# EAGLE schematic KGGR_wD_HK (EAGLE 9.4.2)

## Sheet 1 of 2
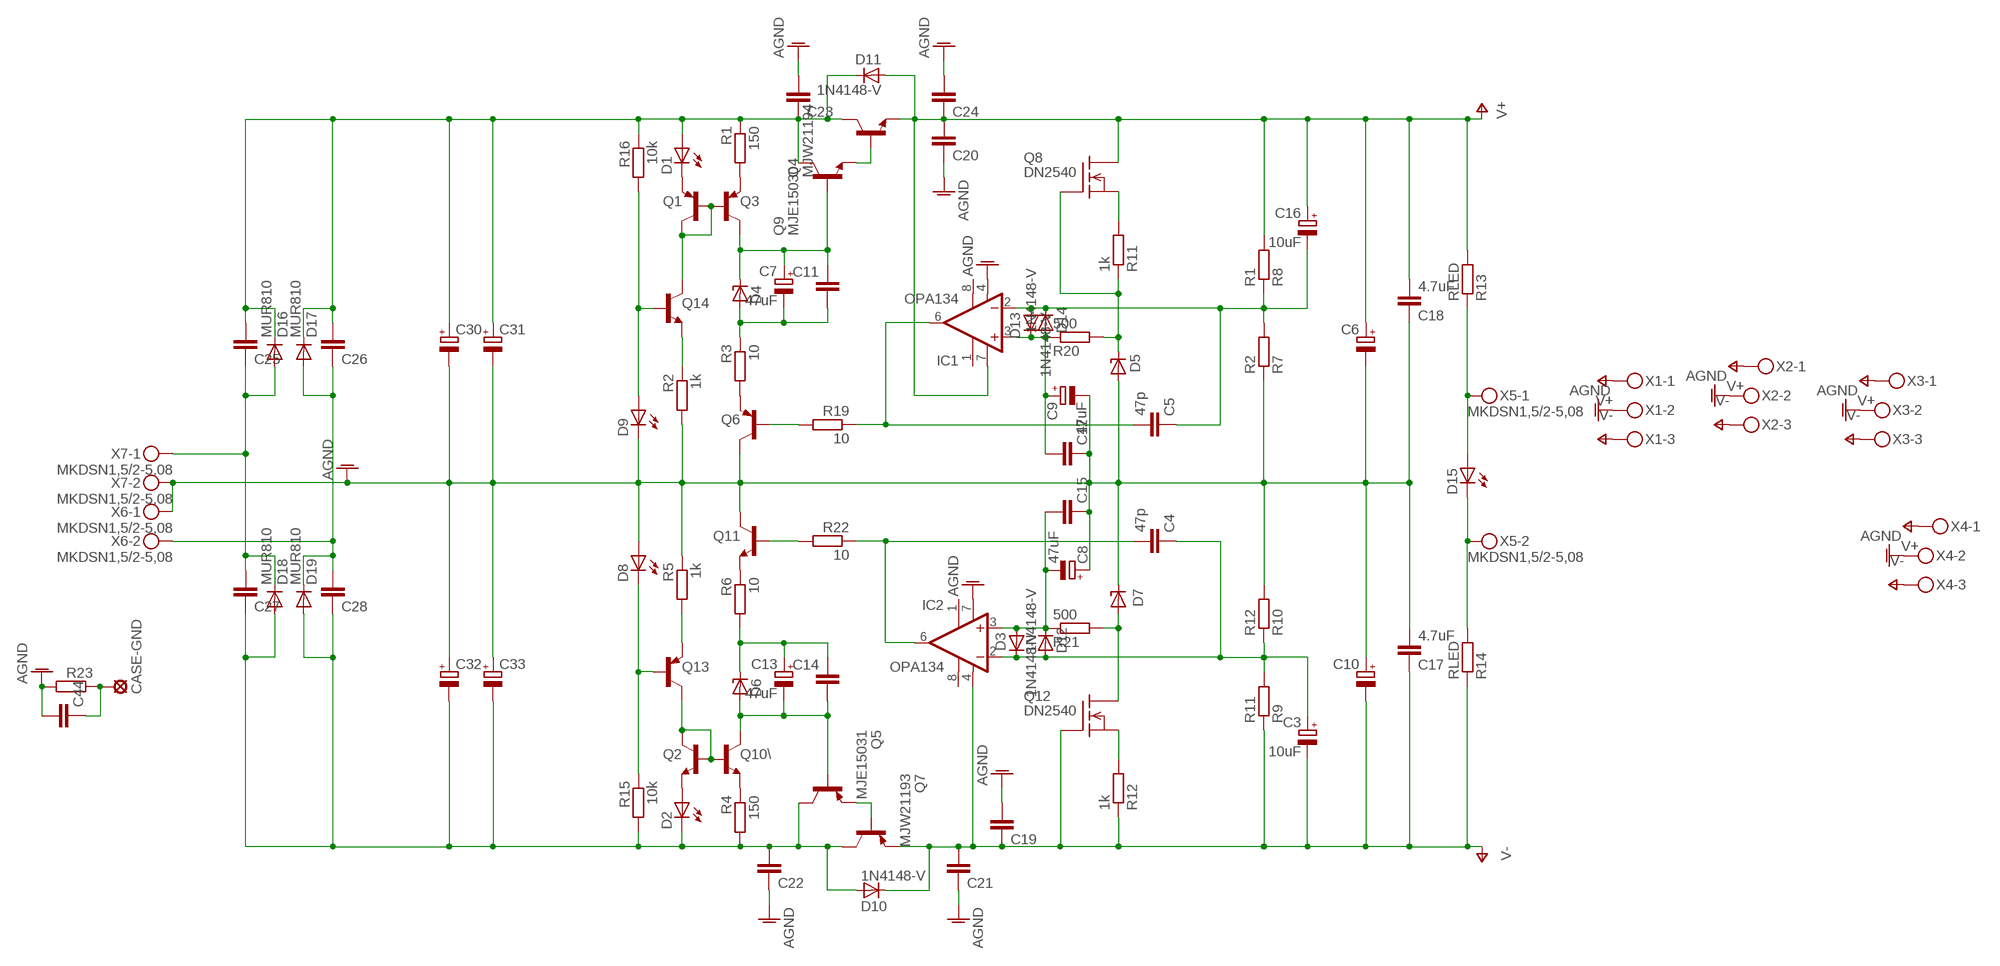
[diagram p0: schematic, sheet 1]

### Parts
C3  10uF  CPOL-EUE5-8.5  [E5-8,5]
C4  47p  C-EU025_050-025X075  [C025_050-025X075]
C5  47p  C-EU025_050-025X075  [C025_050-025X075]
C6  CPOL-EUE7.5-18  [E7,5-18]
C7  47uF  CPOL-EUE5-8.5  [E5-8,5]
C8  47uF  CPOL-EUE5-8.5  [E5-8,5]
C9  47uF  CPOL-EUE5-8.5  [E5-8,5]
C10  CPOL-EUE7.5-18  [E7,5-18]
C11  C-EU050-035X075  [C050-035X075]
C12  C-EU050-035X075  [C050-035X075]
C13  47uF  CPOL-EUE5-8.5  [E5-8,5]
C14  C-EU050-035X075  [C050-035X075]
C15  C-EU050-035X075  [C050-035X075]
C16  10uF  CPOL-EUE5-8.5  [E5-8,5]
C17  4.7uF  C-EU050-075X075  [C050-075X075]
C18  4.7uF  C-EU050-075X075  [C050-075X075]
C19  C-EU050-035X075  [C050-035X075]
C20  C-EU050-035X075  [C050-035X075]
C21  C-EU050-035X075  [C050-035X075]
C22  C-EU050-075X075  [C050-075X075]
C23  C-EU050-075X075  [C050-075X075]
C24  C-EU050-035X075  [C050-035X075]
C25  C-EU050-035X075  [C050-035X075]
C26  C-EU050-035X075  [C050-035X075]
C27  C-EU050-035X075  [C050-035X075]
C28  C-EU050-035X075  [C050-035X075]
C30  CPOL-EUE10-35  [EB35D]
C31  CPOL-EUE10-35  [EB35D]
C32  CPOL-EUE10-35  [EB35D]
C33  CPOL-EUE10-35  [EB35D]
C44  C-EU075-052X106  [C075-052X106]
CASE-GND  SE14  [SE14]
D1  LED5MM  [LED5MM]
D2  LED5MM  [LED5MM]
D3  1N4148-V  [1N4148]
D4  1N4728  [DO41Z10]
D5  LT1021  LT1021-V  [DIL08]
D6  1N4728  [DO41Z10]
D7  LT1021  LT1021-V  [DIL08]
D8  LED5MM  [LED5MM]
D9  LED5MM  [LED5MM]
D10  1N4148-V  [1N4148]
D11  1N4148-V  [1N4148]
D12  1N4148-V  [1N4148]
D13  1N4148-V  [1N4148]
D14  1N4148-V  [1N4148]
D15  LED5MM  [LED5MM]
D16  MUR810  [TO220ACS]
D17  MUR810  [TO220ACS]
D18  MUR810  [TO220ACS]
D19  MUR810  [TO220ACS]
IC1  OPA134  OPA134P  [DIL08]
IC2  OPA134  OPA134P  [DIL08]
Q1  MPSA92-PNP-TO92-EBC  [TO92-EBC]
Q2  MPSA42-NPN-TO92-EBC  [TO92-EBC]
Q3  MPSA92-PNP-TO92-EBC  [TO92-EBC]
Q4  MJW21194  MJL4281  [TO-264]
Q5  MJE15031  [TO220KG]
Q6  MPSA92-PNP-TO92-EBC  [TO92-EBC]
Q7  MJW21193  MJL4302  [TO-264]
Q8  DN2540  2N7000  [TO92-]
Q9  MJE15030  [TO220KG]
Q10\  MPSA42-NPN-TO92-EBC  [TO92-EBC]
Q11  MPSA42-NPN-TO92-EBC  [TO92-EBC]
Q12  DN2540  2N7000  [TO92-]
Q13  MPSA92-PNP-TO92-EBC  [TO92-EBC]
Q14  MPSA42-NPN-TO92-EBC  [TO92-EBC]
R1  150  R-EU_0309/12  [0309/12]
R2  1k  R-EU_0309/12  [0309/12]
R3  10  R-EU_0309/12  [0309/12]
R4  150  R-EU_0309/12  [0309/12]
R5  1k  R-EU_0309/12  [0309/12]
R6  10  R-EU_0309/12  [0309/12]
R7  R2  R-EU_0309/12  [0309/12]
R8  R1  R-EU_0309/12  [0309/12]
R9  R11  R-EU_0309/12  [0309/12]
R10  R12  R-EU_0309/12  [0309/12]
R11  1k  R-EU_0309/12  [0309/12]
R12  1k  R-EU_0309/12  [0309/12]
R13  RLED  R-EU_0309/12  [0309/12]
R14  RLED  R-EU_0309/12  [0309/12]
R15  10k  R-EU_0309/12  [0309/12]
R16  10k  R-EU_0309/12  [0309/12]
R19  10  R-EU_0309/12  [0309/12]
R20  500  R-EU_0309/12  [0309/12]
R21  500  R-EU_0309/12  [0309/12]
R22  10  R-EU_0309/12  [0309/12]
R23  R-EU_0411/12  [0411/12]
X1  MKDSN1,5/3-5,08  [MKDSN1,5/3-5,08]
X2  MKDSN1,5/3-5,08  [MKDSN1,5/3-5,08]
X3  MKDSN1,5/3-5,08  [MKDSN1,5/3-5,08]
X4  MKDSN1,5/3-5,08  [MKDSN1,5/3-5,08]
X5  MKDSN1,5/2-5,08  [MKDSN1,5/2-5,08]
X6  MKDSN1,5/2-5,08  [MKDSN1,5/2-5,08]
X7  MKDSN1,5/2-5,08  [MKDSN1,5/2-5,08]

### Nets
AGND: C6.- C8.+ C9.- C10.+ C12.1 C15.1 C17.2 C18.1 C19.2 C20.1 C21.1 C22.1 C23.2 C24.2 C30.- C31.- C32.+ C33.+ C44.2 D5.4(GND) D7.6(OUT) D8.A D9.K(C) IC1.4(V-) IC2.7(V+) Q6.C Q11.C R2.2 R5.1 R7.1 R10.2 R23.2 X1.2 X2.2 X3.2 X4.2 X6.1 X7.2
N$1: Q1.B Q1.C Q3.B Q14.C
N$2: D1.K(C) Q1.E
N$3: Q3.E R1.2
N$4: C23.1 C25.2 C26.2 C30.+ C31.+ D1.A D11.C D16.C D17.C Q4.C Q9.2(C) R1.1 R16.1
N$5: C7.+ C11.1 D4.C Q3.C Q9.1(B)
N$6: C7.- C11.2 D4.A R3.1
N$7: Q6.E R3.2
N$8: Q14.E R2.1
N$9: D9.A Q14.B R16.2
N$10: C8.- C15.2 D3.A D12.C IC2.3(+IN) R21.1
N$11: Q13.E R5.2
N$12: D8.K(C) Q13.B R15.1
N$13: Q11.E R6.1
N$14: C13.+ C14.1 D6.C R6.2
N$15: C13.- C14.2 D6.A Q5.1(B) Q10\.C
N$16: Q2.B Q2.C Q10\.B Q13.C
N$17: Q5.3(E) Q7.B
N$18: Q10\.E R4.1
N$19: D2.A Q2.E
N$21: Q4.B Q9.3(E)
N$22: C22.2 C27.1 C28.1 C32.- C33.- D2.K(C) D10.A D18.A D19.A Q5.2(C) Q7.C R4.2 R15.2
N$23: C25.1 C27.2 D16.A D18.C X7.1
N$24: C5.2 C5.3 IC1.6(OUT) R19.1
N$25: C4.2 C4.3 IC2.6(OUT) R22.1
N$26: Q11.B R22.2
N$27: Q6.B R19.2
N$28: C5.1 C16.- D13.A D14.C IC1.2(-IN) R7.2 R8.1
N$29: Q12.3(S) R12.2
N$30: D5.6(OUT) Q8.2(G) R11.1 R20.2
N$31: C9.+ C12.2 D13.C D14.A IC1.3(+IN) R20.1
N$32: D15.K(C) R14.2 X5.2
N$33: D7.4(GND) Q12.1(D) R21.2
N$34: C3.+ C4.1 D3.C D12.A IC2.2(-IN) R9.2 R10.1
N$35: Q8.3(S) R11.2
N$36: D15.A R13.1 X5.1
N$38: C26.1 C28.2 D17.A D19.C X6.2
N$45: C44.1 CASE-GND.MP R23.1
V+: C6.+ C16.+ C18.2 C20.2 C24.1 D11.A IC1.7(V+) Q4.E Q8.1(D) R8.2 R13.2 X1.1 X2.1 X3.1 X4.1
V-: C3.- C10.- C17.1 C19.1 C21.2 D10.C IC2.4(V-) Q7.E Q12.2(G) R9.1 R12.1 R14.1 X1.3 X2.3 X3.3 X4.3
Unconnected: IC1.1(TRIM1) IC1.8(TRIM2) IC2.1(TRIM1) IC2.8(TRIM2)

## Sheet 2 of 2
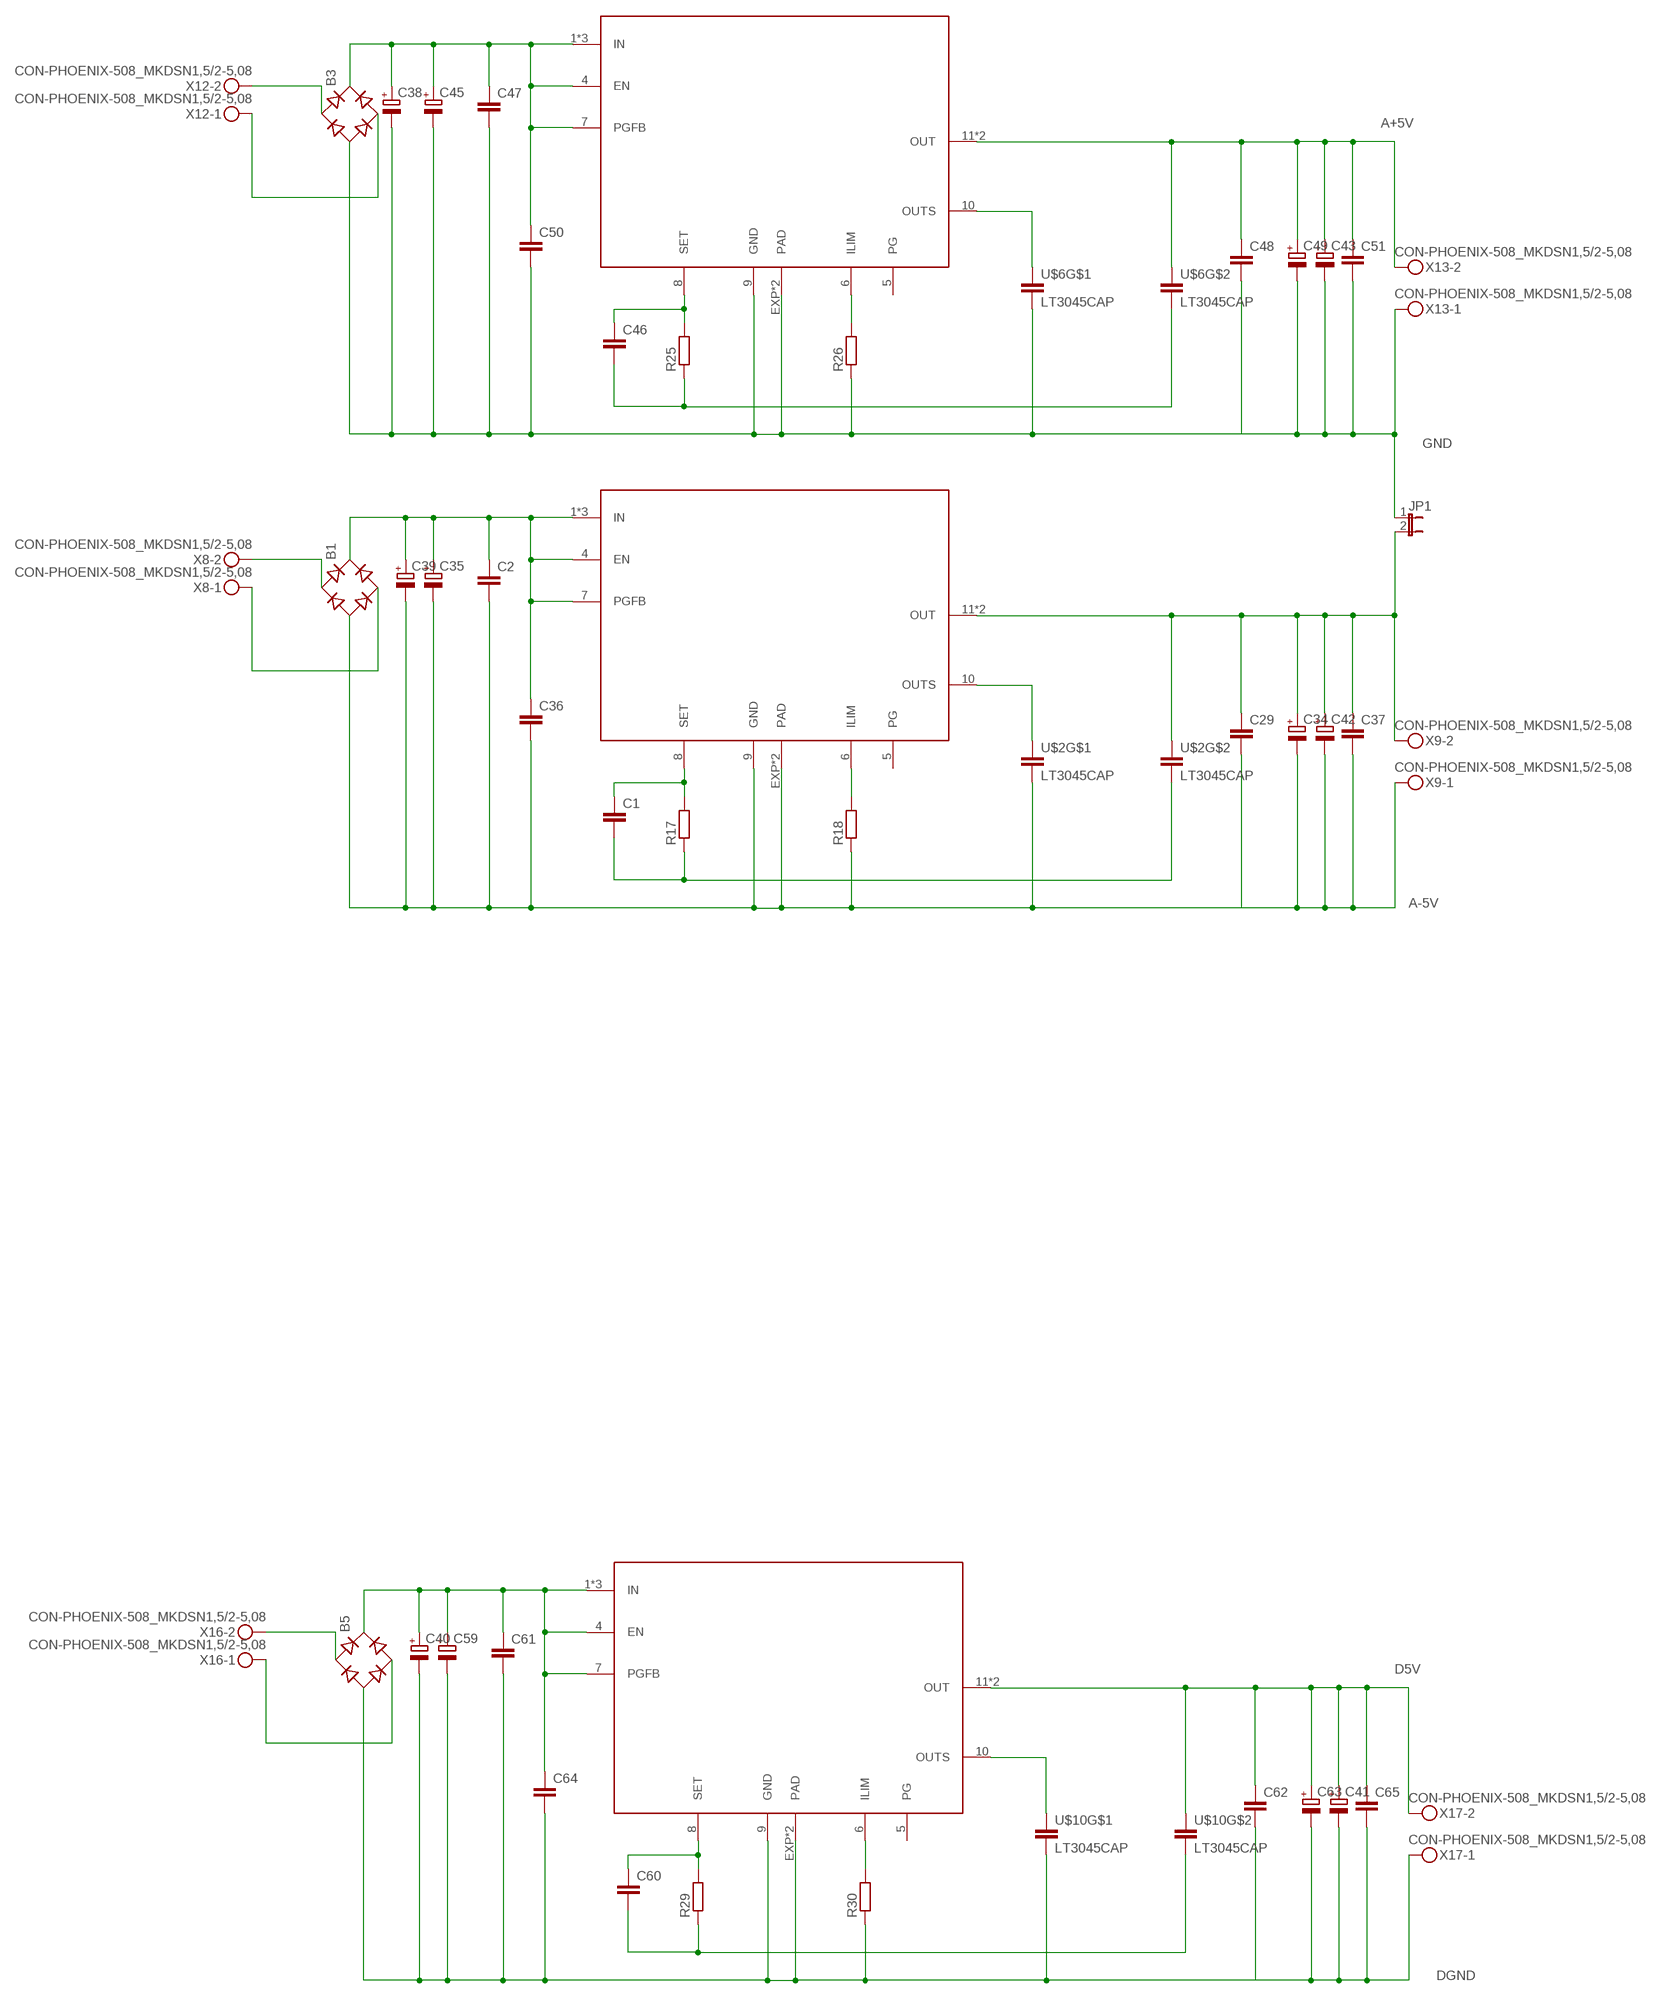
[diagram p1: schematic, sheet 2]

### Parts
B1  RB1A  [RB1A]
B3  RB1A  [RB1A]
B5  RB1A  [RB1A]
C1  C-EUC1206  [C1206]
C2  C-EU050-050X075  [C050-050X075]
C29  C-EU050-050X075  [C050-050X075]
C34  CPOL-EUE5-10.5  [E5-10,5]
C35  CPOL-EUE10-25  [EB25D]
C36  C-EUC1206  [C1206]
C37  C-EUC1206  [C1206]
C38  CPOL-EUSP-CAP-CX  [SP-CAP-CX]
C39  CPOL-EUSP-CAP-CX  [SP-CAP-CX]
C40  CPOL-EUSP-CAP-CX  [SP-CAP-CX]
C41  CPOL-EUSP-CAP-CX  [SP-CAP-CX]
C42  CPOL-EUSP-CAP-CX  [SP-CAP-CX]
C43  CPOL-EUSP-CAP-CX  [SP-CAP-CX]
C45  CPOL-EUE10-25  [EB25D]
C46  C-EUC1206  [C1206]
C47  C-EU050-050X075  [C050-050X075]
C48  C-EU050-050X075  [C050-050X075]
C49  CPOL-EUE5-10.5  [E5-10,5]
C50  C-EUC1206  [C1206]
C51  C-EUC1206  [C1206]
C59  CPOL-EUE10-25  [EB25D]
C60  C-EUC1206  [C1206]
C61  C-EU050-050X075  [C050-050X075]
C62  C-EU050-050X075  [C050-050X075]
C63  CPOL-EUE5-10.5  [E5-10,5]
C64  C-EUC1206  [C1206]
C65  C-EUC1206  [C1206]
JP1  JP1E  [JP1]
R17  R-EU_MELF0204R  [MINI_MELF-0204R]
R18  R-EU_MELF0204R  [MINI_MELF-0204R]
R25  R-EU_MELF0204R  [MINI_MELF-0204R]
R26  R-EU_MELF0204R  [MINI_MELF-0204R]
R29  R-EU_MELF0204R  [MINI_MELF-0204R]
R30  R-EU_MELF0204R  [MINI_MELF-0204R]
U$1  LT3045  [MSOP12]
U$2  LT3045CAP  [LT3045CAP]
U$5  LT3045  [MSOP12]
U$6  LT3045CAP  [LT3045CAP]
U$9  LT3045  [MSOP12]
U$10  LT3045CAP  [LT3045CAP]
X8  CON-PHOENIX-508_MKDSN1,5/2-5,08  [CON-PHOENIX-508_MKDSN1,5/2-5,08]
X9  CON-PHOENIX-508_MKDSN1,5/2-5,08  [CON-PHOENIX-508_MKDSN1,5/2-5,08]
X12  CON-PHOENIX-508_MKDSN1,5/2-5,08  [CON-PHOENIX-508_MKDSN1,5/2-5,08]
X13  CON-PHOENIX-508_MKDSN1,5/2-5,08  [CON-PHOENIX-508_MKDSN1,5/2-5,08]
X16  CON-PHOENIX-508_MKDSN1,5/2-5,08  [CON-PHOENIX-508_MKDSN1,5/2-5,08]
X17  CON-PHOENIX-508_MKDSN1,5/2-5,08  [CON-PHOENIX-508_MKDSN1,5/2-5,08]

### Nets
A+5V: C43.+ C48.1 C49.+ C51.1 U$5.11(OUT) U$5.12(OUT) U$6.4 X13.2
A-5V: B1.- C2.2 C29.2 C34.- C35.- C36.2 C37.2 C39.- C42.- R18.1 U$1.9(GND) U$1.EXP1(PAD) U$1.EXP(PAD) U$2.5 X9.1
D5V: C41.+ C62.1 C63.+ C65.1 U$9.11(OUT) U$9.12(OUT) U$10.4 X17.2
DGND: B5.- C40.- C41.- C59.- C61.2 C62.2 C63.- C64.2 C65.2 R30.1 U$9.9(GND) U$9.EXP1(PAD) U$9.EXP(PAD) U$10.5 X17.1
GND: B3.- C38.- C43.- C45.- C47.2 C48.2 C49.- C50.2 C51.2 JP1.1 R26.1 U$5.9(GND) U$5.EXP1(PAD) U$5.EXP(PAD) U$6.5 X13.1
IN1: B1.+ C2.1 C35.+ C36.1 C39.+ U$1.1(IN) U$1.2(IN) U$1.3(IN) U$1.4(EN) U$1.7(PGFB)
IN2: B3.+ C38.+ C45.+ C47.1 C50.1 U$5.1(IN) U$5.2(IN) U$5.3(IN) U$5.4(EN) U$5.7(PGFB)
IN3: B5.+ C40.+ C59.+ C61.1 C64.1 U$9.1(IN) U$9.2(IN) U$9.3(IN) U$9.4(EN) U$9.7(PGFB)
N$44: U$1.10(OUTS) U$2.3
N$46: U$5.10(OUTS) U$6.3
N$47: R18.2 U$1.6(ILIM)
N$48: B1.AC2 X8.1
N$49: B1.AC1 X8.2
N$50: R26.2 U$5.6(ILIM)
N$51: B3.AC2 X12.1
N$52: B3.AC1 X12.2
N$57: U$9.10(OUTS) U$10.3
N$58: R30.2 U$9.6(ILIM)
N$59: B5.AC2 X16.1
N$60: B5.AC1 X16.2
OUT1: C29.1 C34.+ C37.1 C42.+ JP1.2 U$1.11(OUT) U$1.12(OUT) U$2.4 X9.2
SET1: C1.1 R17.2 U$1.8(SET)
SET2: C46.1 R25.2 U$5.8(SET)
SET3: C60.1 R29.2 U$9.8(SET)
SGND1: C1.2 R17.1 U$2.6
SGND2: C46.2 R25.1 U$6.6
SGND3: C60.2 R29.1 U$10.6
Unconnected: U$1.5(PG) U$5.5(PG) U$9.5(PG)

## Library data of the parts
B1 B3 B5 = rectifier:RB1A: RECTIFIER 1 A
C1 C2 C4 C5 C11 C12 C14 C15 C17-C29 C36 C37 C44 C46-C48 C50 C51 C60-C62 C64 C65 = Vwvwbg:C-EU: CAPACITOR, European symbol
C3 C6-C10 C13 C16 C30-C35 C38-C43 C45 C49 C59 C63 = Vwvwbg:CPOL-EU: POLARIZED CAPACITOR, European symbol
CASE-GND = solpad:SE14: SOLDER PAD E1553, drill 1,4mm, distributor Buerklin, 07F820
D1 D2 D8 D9 D15 = led:LED: LED OSRAM: - CHIPLED LG R971, LG N971, LY N971, LG Q971, LY Q971, LO R971, LY R971 LH N974, LH R974 LS Q976, LO Q976, LY Q976 LO Q996 - Hyper CHIPLED LW Q18S LB Q993, LB Q99A, LB R99A - SideLED LS A670, LO A670, LY A670, LG A670, LP A670 LB A673, LV A673, LT A673, LW A673 LH A674 LY A675 LS A676, LA A676, LO A676, LY A676, LW A676 LS A679, LY A679, LG A679 - Hyper Micro SIDELED® LS Y876, LA Y876, LO Y876, LY Y876 LT Y87S - SmartLED LW L88C, LW L88S LB L89C, LB L89S, LG L890 LS L89K, LO L89K, LY L89K LS L896, LA L896, LO L896, LY L896 - TOPLED LS T670, LO T670, LY T670, LG T670, LP T670 LSG T670, LSP T670, LSY T670, LOP T670, LYG T670 LG T671, LOG T671, LSG T671 LB T673, LV T673, LT T673, LW T673 LH T674 LS T676, LA T676, LO T676, LY T676, LB T676, LH T676, LSB T676, LW T676 LB T67C, LV T67C, LT T67C, LS T67K, LO T67K, LY T67K, LW E67C LS E67B, LA E67B, LO E67B, LY E67B, LB E67C, LV E67C, LT E67C LW T67C LS T679, LY T679, LG T679 LS T770, LO T770, LY T770, LG T770, LP T770 LB T773, LV T773, LT T773, LW T773 LH T774 LS E675, LA E675, LY E675, LS T675 LS T776, LA T776, LO T776, LY T776, LB T776 LHGB T686 LT T68C, LB T68C - Hyper Mini TOPLED® LB M676 - Mini TOPLED Santana® LG M470 LS M47K, LO M47K, LY M47K Source: http://www.osram.convergy.de LUXEON: - LUMILED® LXK2-PW12-R00, LXK2-PW12-S00, LXK2-PW14-U00, LXK2-PW14-V00 LXK2-PM12-R00, LXK2-PM12-S00, LXK2-PM14-U00 LXK2-PE12-Q00, LXK2-PE12-R00, LXK2-PE12-S00, LXK2-PE14-T00, LXK2-PE14-U00 LXK2-PB12-K00, LXK2-PB12-L00, LXK2-PB12-M00, LXK2-PB14-N00, LXK2-PB14-P00, LXK2-PB14-Q00 LXK2-PR12-L00, LXK2-PR12-M00, LXK2-PR14-Q00, LXK2-PR14-R00 LXK2-PD12-Q00, LXK2-PD12-R00, LXK2-PD12-S00 LXK2-PH12-R00, LXK2-PH12-S00 LXK2-PL12-P00, LXK2-PL12-Q00, LXK2-PL12-R00 Source: www.luxeon.com KINGBRIGHT: KA-3528ASYC Source: www.kingbright.com
D3 D10-D14 = diode:1N4148-V
D4 D6 = diode:1N4728: Z DIODE 3.3 V, 1W, 5 percent
D5 D7 = linear-technology:LT1021-V
D16-D19 = diode:MUR810: DIODE
IC1 IC2 = burr-brown:OPA134: Operational Amplifiers SoundPlus(TM) High Performance Audio; MF: TEXAS INSTRUMENTS; MPN: OPA134PA; OC_FARNELL: 1335032; OC_NEWARK: 75C4599
JP1 = jumper:JP1E: JUMPER
Q1 Q3 Q6 Q13 = transistor:*-PNP-: PNP Transistror
Q2 Q10\ Q11 Q14 = transistor:*-NPN-: NPN Transistror BF959 corrected 2008.03.06
Q4 = TO264:MJL4281: MJL4281 NPN BCE TO-264
Q5 = transistor:MJE15031
Q7 = TO264:MJL4302: MJL4302 PNP BCE TO-264
Q8 Q12 = tranzistory FET:2N7000
Q9 = transistor:MJE15030
R1-R23 R25 R26 R29 R30 = Vwvwbg:R-EU_: RESISTOR, European symbol
U$1 U$5 U$9 = Vwvwbg:LT3045
U$2 U$6 U$10 = Vwvwbg:LT3045CAP
X1-X4 = con-phoenix-508:MKDSN1,5/3-5,08: MKDSN 1,5/ 3-5,08 Printklemme Nennstrom: 13,5 A Nennspannung: 250 V Rastermaß: 5,08 mm Polzahl: 3 Anschlussart: Schraubanschluss Montage: Löten Anschlussrichtung Leiter/Platine: 0 ° Artikelnummer: 1729131 Source: http://eshop.phoenixcontact.com .. 1729131.pdf
X5-X7 = con-phoenix-508:MKDSN1,5/2-5,08: MKDSN 1,5/ 2-5,08 Printklemme Nennstrom: 13,5 A Nennspannung: 250 V Rastermaß: 5,08 mm Polzahl: 2 Anschlussart: Schraubanschluss Montage: Löten Anschlussrichtung Leiter/Platine: 0 ° Artikelnummer: 1729128 Source: http://eshop.phoenixcontact.com .. 1729128.pdf
X8 X9 X12 X13 X16 X17 = Vwvwbg:CON-PHOENIX-508_MKDSN1,5/2-5,08: MKDSN 1,5/ 2-5,08 Printklemme Nennstrom: 13,5 A Nennspannung: 250 V Rastermaß: 5,08 mm Polzahl: 2 Anschlussart: Schraubanschluss Montage: Löten Anschlussrichtung Leiter/Platine: 0 ° Artikelnummer: 1729128 Source: http://eshop.phoenixcontact.com .. 1729128.pdf